# EAGLE design wifi-leds2 (EAGLE 9.5.0)

## Sheet 1 of 5
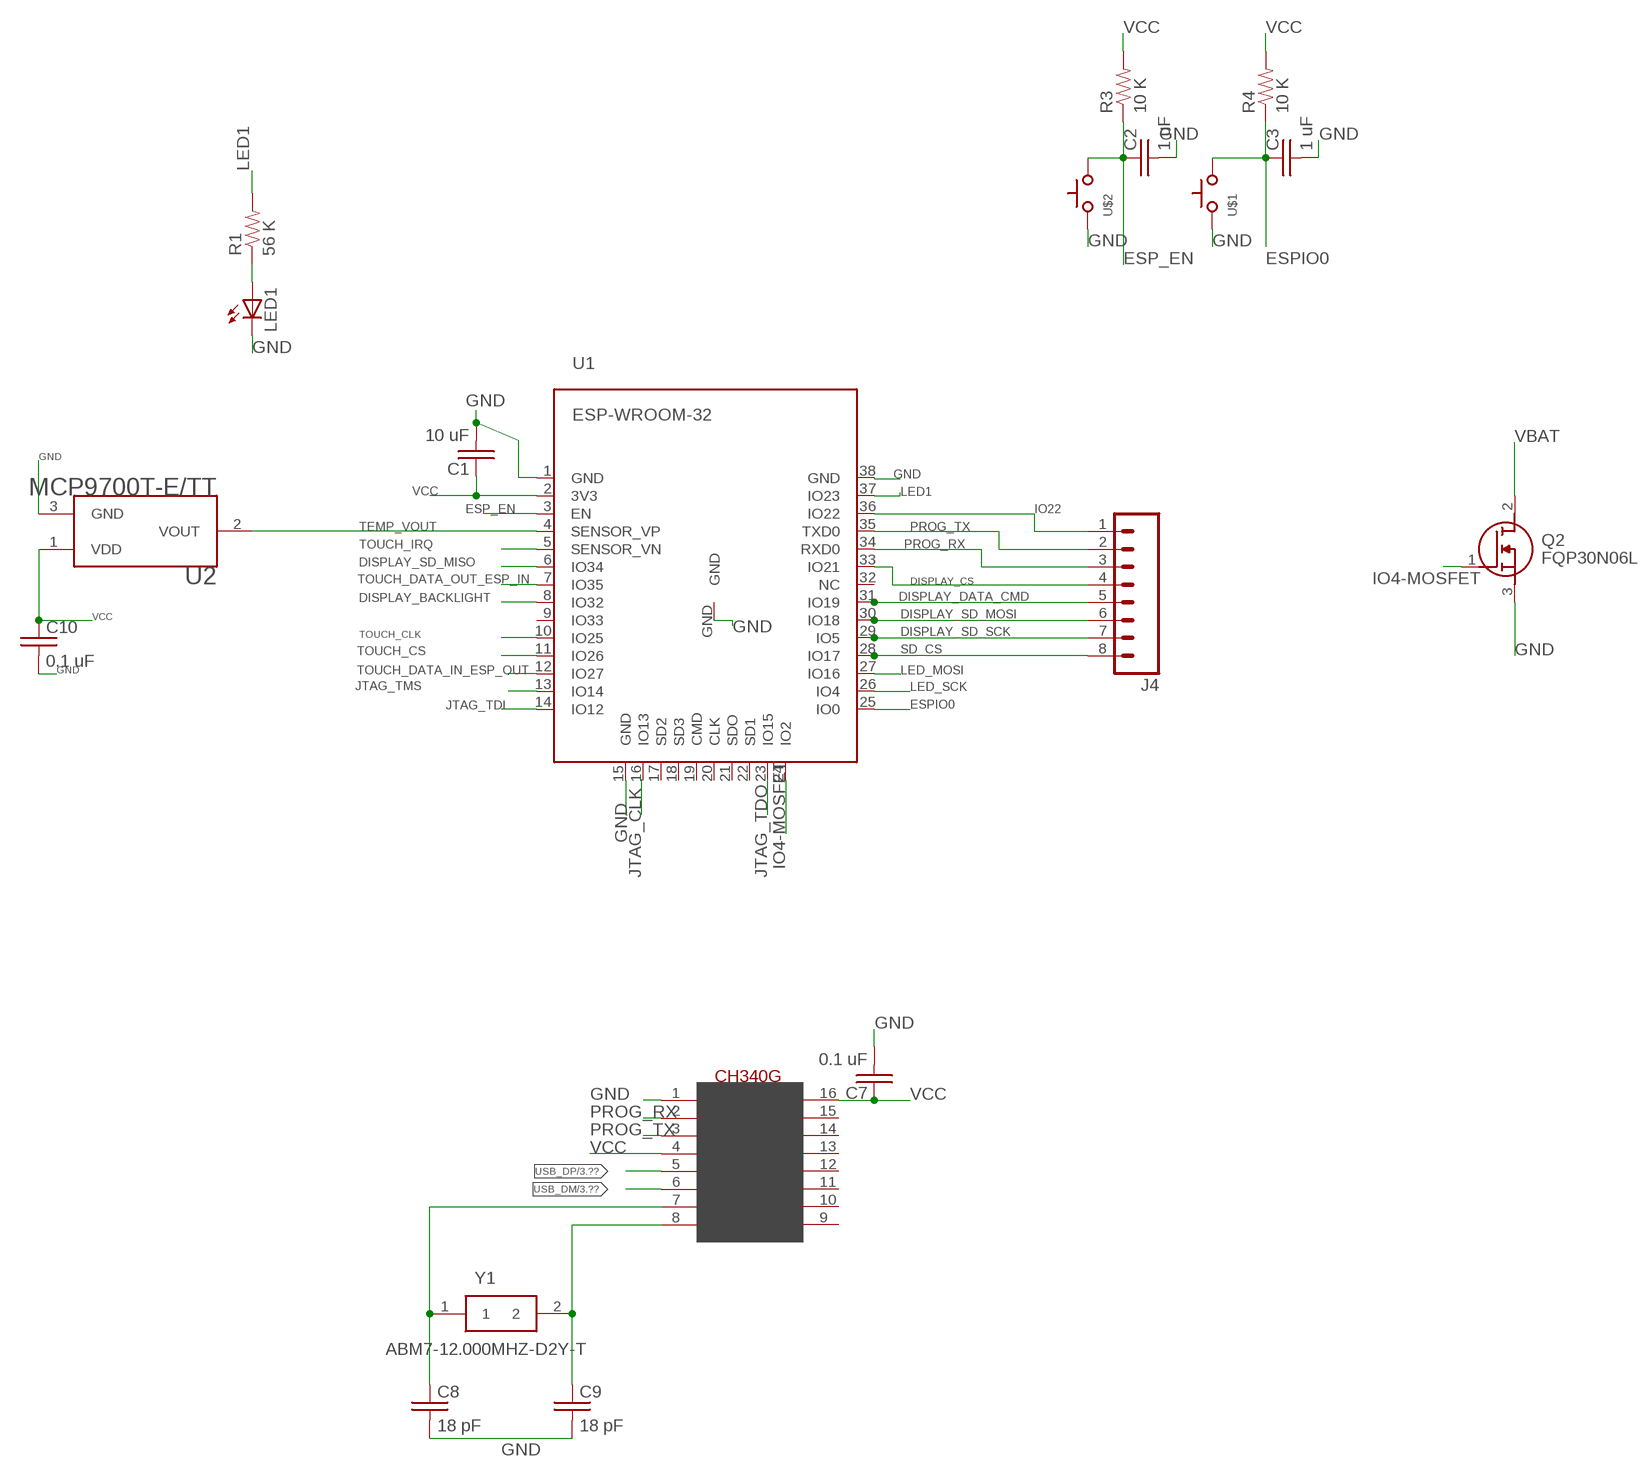
[diagram p0: schematic, sheet 1]

### Parts
C1  10 uF  C-USC0805  [C0805]
C2  1 uF  C-USC0805  [C0805]
C3  1 uF  C-USC0805  [C0805]
C7  0.1 uF  C-USC0805  [C0805]
C8  18 pF  C-USC0805  [C0805]
C9  18 pF  C-USC0805  [C0805]
C10  0.1 uF  C-USC0805  [C0805]
J4  M08  [1X08_ROUND]
LED1  LED3MM  [LED3MM]
Q2  FQP30N06L  [TO254P470X1016X2019-3P]
R1  56 K  RESISTOR0805-RES  [0805]
R3  10 K  RESISTOR0805-RES  [0805]
R4  10 K  RESISTOR0805-RES  [0805]
U1  ESP-WROOM-32  [ESP-WROOM-32]
U2  MCP9700T-E/TT  [SOT95P237X112-3N]
U$1  SWITCH_TACTILETACTILE-2PIN-NARROW  [TACTILE-2PIN-NARROW]
U$2  SWITCH_TACTILETACTILE-2PIN-NARROW  [TACTILE-2PIN-NARROW]
U$6  CH340G  [SOIC16]
Y1  ABM7-12.000MHZ-D2Y-T  [ABM7]

### Nets
DISPLAY_BACKLIGHT: U1.8(IO32) ; also sheet 4
DISPLAY_CS: J4.4 U1.33(IO21) ; also sheet 4
DISPLAY_DATA_CMD: J4.5 U1.31(IO19) ; also sheet 4
DISPLAY_SD_MISO: U1.6(IO34) ; also sheet 4
DISPLAY_SD_MOSI: J4.6 U1.30(IO18) ; also sheet 4
DISPLAY_SD_SCK: J4.7 U1.29(IO5) ; also sheet 4
ESP_EN: C2.1 R3.1 U1.3(EN) U$2.P$1(A)
ESPIO0: C3.1 R4.1 U1.25(IO0) U$1.P$1(A)
GND: C1.2 C2.2 C3.2 C7.2 C8.2 C9.2 C10.2 LED1.K(C) Q2.3(S) U1.1(GND) U1.15(GND) U1.38(GND) U1.GND U2.3(GND) U$1.P$2(C) U$2.P$2(C) U$6.1(GND) ; also sheet 2,3,4
IO4-MOSFET: Q2.1(G) U1.24(IO2)
IO22: J4.1 U1.36(IO22)
JTAG_CLK: U1.16(IO13) ; also sheet 2
JTAG_TDI: U1.14(IO12) ; also sheet 2
JTAG_TDO: U1.23(IO15) ; also sheet 2
JTAG_TMS: U1.13(IO14) ; also sheet 2
LED1: R1.2 U1.37(IO23)
LED_MOSI: U1.27(IO16) ; also sheet 2
LED_SCK: U1.26(IO4) ; also sheet 2
N$1: LED1.A R1.1
N$8: C8.1 U$6.7(XI) Y1.1
N$9: C9.1 U$6.8(XO) Y1.2
PROG_RX: J4.3 U1.34(RXD0) U$6.2(TX) ; also sheet 2
PROG_TX: J4.2 U1.35(TXD0) U$6.3(RX) ; also sheet 2
SD_CS: J4.8 U1.28(IO17) ; also sheet 4
TEMP_VOUT: U1.4(SENSOR_VP) U2.2(VOUT)
TOUCH_CLK: U1.10(IO25) ; also sheet 4
TOUCH_CS: U1.11(IO26) ; also sheet 4
TOUCH_DATA_IN_ESP_OUT: U1.12(IO27) ; also sheet 4
TOUCH_DATA_OUT_ESP_IN: U1.7(IO35) ; also sheet 4
TOUCH_IRQ: U1.5(SENSOR_VN) ; also sheet 4
USB_DM: U$6.6(D-) ; also sheet 3
USB_DP: U$6.5(D+) ; also sheet 3
VBAT [5v]: Q2.2(D) ; also sheet 2,3
VCC: C1.1 C7.1 C10.1 R3.2 R4.2 U1.2(3V3) U2.1(VDD) U$6.4(V3) U$6.16(VCC) ; also sheet 2,3,4
Unconnected: U1.9(IO33) U1.17(SD2) U1.18(SD3) U1.19(CMD) U1.20(CLK) U1.21(SDO) U1.22(SD1) U1.32(NC) U$6.9(CTS) U$6.10(DSR) U$6.11(RI) U$6.12(DCD) U$6.13(DTR) U$6.14(RTS) U$6.15(RS232)

## Sheet 2 of 5
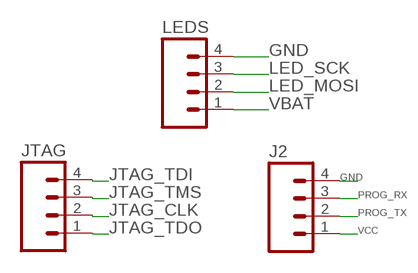
[diagram p1: schematic, sheet 2]

### Parts
J2  M04PTH  [1X04]
JTAG  M04PTH  [1X04]
LEDS  M04POLAR  [MOLEX-1X4]

### Nets
GND: J2.4 LEDS.4 ; also sheet 1,3,4
JTAG_CLK: JTAG.2 ; also sheet 1
JTAG_TDI: JTAG.4 ; also sheet 1
JTAG_TDO: JTAG.1 ; also sheet 1
JTAG_TMS: JTAG.3 ; also sheet 1
LED_MOSI: LEDS.2 ; also sheet 1
LED_SCK: LEDS.3 ; also sheet 1
PROG_RX: J2.3 ; also sheet 1
PROG_TX: J2.2 ; also sheet 1
VBAT [5v]: LEDS.1 ; also sheet 1,3
VCC: J2.1 ; also sheet 1,3,4

## Sheet 3 of 5
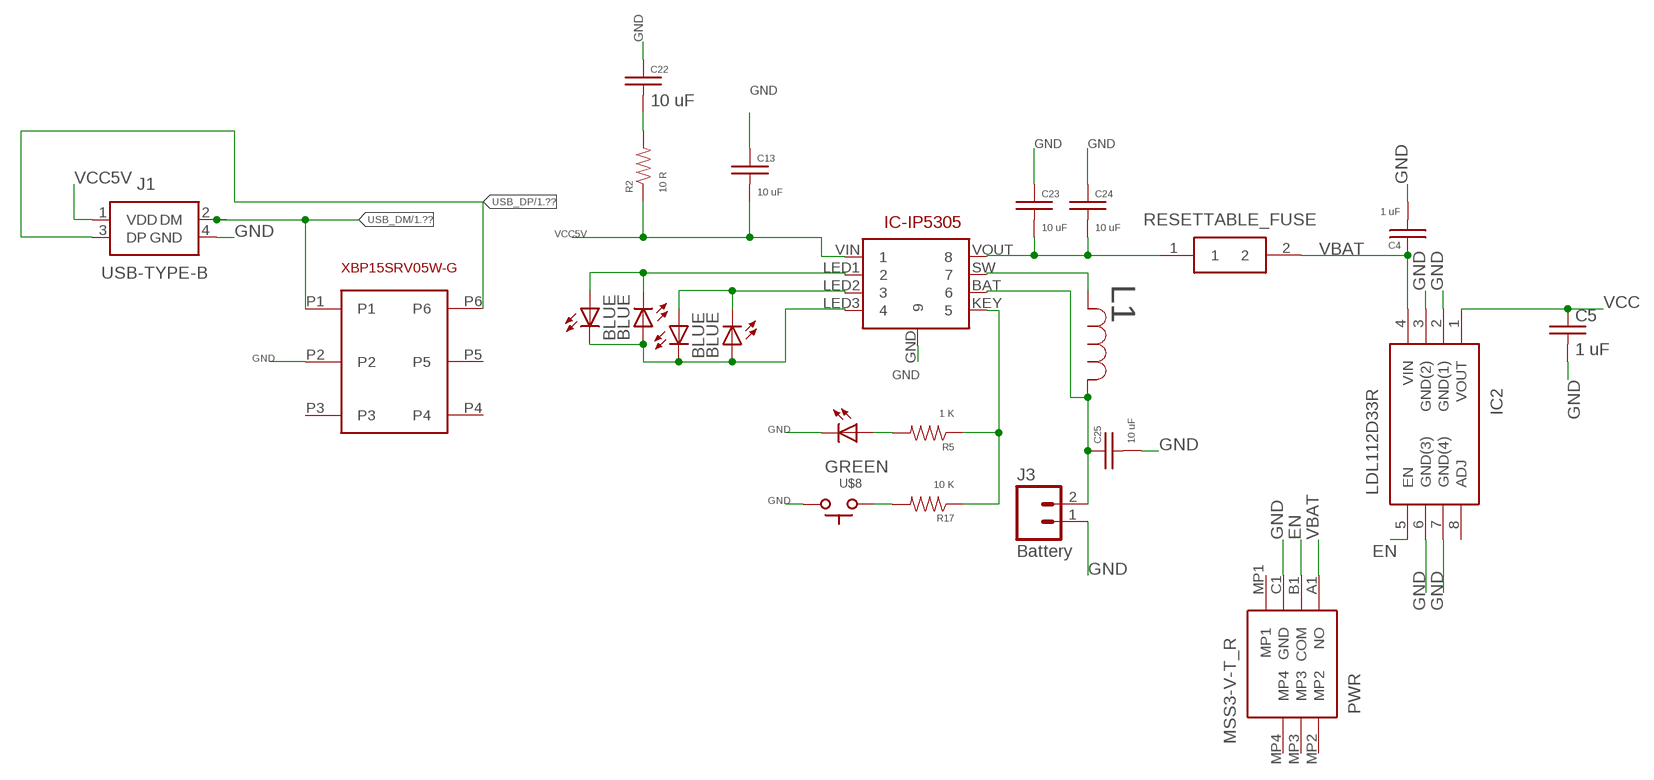
[diagram p2: schematic, sheet 3]

### Parts
C4  1 uF  C-USC0805  [C0805]
C5  1 uF  C-USC0805  [C0805]
C13  10 uF  C-USC0805  [C0805]
C22  10 uF  C-USC0805  [C0805]
C23  10 uF  C-USC0805  [C0805]
C24  10 uF  C-USC0805  [C0805]
C25  10 uF  C-USC0805  [C0805]
CL1  BLUE  LED1206  [LED-1206]
CL2  BLUE  LED1206  [LED-1206]
CL3  BLUE  LED1206  [LED-1206]
CL4  BLUE  LED1206  [LED-1206]
IC2  LDL112D33R  [SOIC127P600X175-8N]
IC-IP5305  IP5305ESOP8  [SOIC127P600X165-8]
J1  USB-TYPE-B  [61400413321]
J3  Battery  M02JST-PTH-2  [JST-2-PTH]
KEYLED  GREEN  LED1206  [LED-1206]
L1  2.2uH  NRS4018T2R2MDGJ  [IND_TAIYO_NRS4018]
PWR  MSS3-V-T_R  [MSS3VTR]
R2  10 R  RESISTOR0805-RES  [0805]
R5  1 K  RESISTOR0805-RES  [0805]
R17  10 K  RESISTOR0805-RES  [0805]
RESETTABLE_FUSE  0ZCJ0050FF2G  [FUSC3216X55N]
U$8  SWITCH_TACTILETACTILE-2PIN-NARROW  [TACTILE-2PIN-NARROW]
U$9  XBP15SRV05W-G  [SOT-26P-XBP15SRV05W-G]

### Nets
EN: IC2.5(EN) PWR.B1(COM)
GND: C4.2 C5.2 C13.1 C22.1 C23.1 C24.1 C25.2 IC2.2(GND(1)) IC2.3(GND(2)) IC2.6(GND(3)) IC2.7(GND(4)) IC-IP5305.GND J1.4(GND) J3.1 KEYLED.C PWR.C1(GND) U$8.P$1(A) U$9.P2 ; also sheet 1,2,4
N$5: CL1.A CL2.C IC-IP5305.LED1
N$14: CL3.A CL4.C IC-IP5305.LED2
N$15: CL1.C CL2.A CL3.C CL4.A IC-IP5305.LED3
N$16: C22.2 R2.2
N$17: IC-IP5305.SW L1.2
N$20: C25.1 IC-IP5305.BAT J3.2 L1.1
N$21: IC-IP5305.KEY R5.1 R17.1
N$24: KEYLED.A R5.2
N$25: R17.2 U$8.P$2(C)
N$27: C23.2 C24.2 IC-IP5305.VOUT RESETTABLE_FUSE.1
USB_DM: J1.2(DM) U$9.P1 ; also sheet 1
USB_DP: J1.3(DP) U$9.P6 ; also sheet 1
VBAT [5v]: C4.1 IC2.4(VIN) PWR.A1(NO) RESETTABLE_FUSE.2 ; also sheet 1,2
VCC: C5.1 IC2.1(VOUT) ; also sheet 1,2,4
VCC5V [5v]: C13.2 IC-IP5305.VIN J1.1(VDD) R2.1
Unconnected: IC2.8(ADJ) PWR.MP1 PWR.MP2 PWR.MP3 PWR.MP4 U$9.P3 U$9.P4 U$9.P5

## Sheet 4 of 5
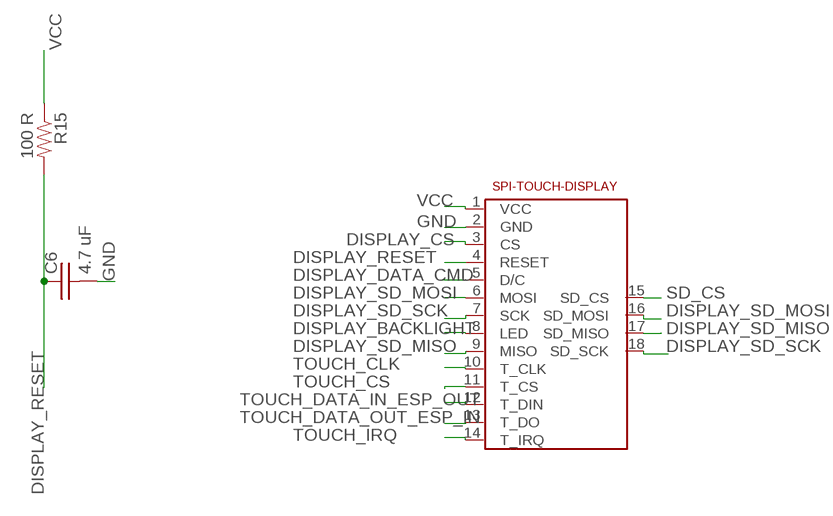
[diagram p3: schematic, sheet 4]

### Parts
C6  4.7 uF  C-USC0805  [C0805]
R15  100 R  RESISTOR0805-RES  [0805]
U$3  2.4-SPI-TFT-TOUCH-SSD-MODULE  [2.4-SPI-TFT-TOUCH-SSD-MODULE]

### Nets
DISPLAY_BACKLIGHT: U$3.8(LED) ; also sheet 1
DISPLAY_CS: U$3.3(CS) ; also sheet 1
DISPLAY_DATA_CMD: U$3.5(D/C) ; also sheet 1
DISPLAY_RESET: C6.1 R15.2 U$3.4(RESET)
DISPLAY_SD_MISO: U$3.9(MISO) U$3.17(SD_MISO) ; also sheet 1
DISPLAY_SD_MOSI: U$3.6(MOSI) U$3.16(SD_MOSI) ; also sheet 1
DISPLAY_SD_SCK: U$3.7(SCK) U$3.18(SD_SCK) ; also sheet 1
GND: C6.2 U$3.2(GND) ; also sheet 1,2,3
SD_CS: U$3.15(SD_CS) ; also sheet 1
TOUCH_CLK: U$3.10(T_CLK) ; also sheet 1
TOUCH_CS: U$3.11(T_CS) ; also sheet 1
TOUCH_DATA_IN_ESP_OUT: U$3.12(T_DIN) ; also sheet 1
TOUCH_DATA_OUT_ESP_IN: U$3.13(T_DO) ; also sheet 1
TOUCH_IRQ: U$3.14(T_IRQ) ; also sheet 1
VCC: R15.1 U$3.1(VCC) ; also sheet 1,2,3

## Sheet 5 of 5
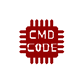
[diagram p4: schematic, sheet 5]

### Parts
U$5  CMD_C0DE_LOGOCMD_CODE_LOGO_TOP_COPPER  [CMD_C0DE_LOGO_TOP_COPPER]

## Library data of the parts
C1-C10 C13 C22-C25 = passives:C-US: CAPACITOR, American symbol
CL1-CL4 KEYLED LED1 = leds:LED: LEDs Standard schematic elements and footprints for 5mm, 3mm, 1206, and 0603 sized LEDs. 5mm - Spark Fun Electronics SKU : COM-00529 (and others)
IC2 = voltage-regulator:LDL112D33R: LDO Voltage Regulators 1.2 A low quiescent current LDO with reverse current protection Source: Datasheet <https://www.arrow.com/en/products/ldl112d33r/stmicroelectronics>; ARROW_PART_NUMBER: LDL112D33R; ARROW_PRICE/STOCK: https://www.arrow.com/en/products/ldl112d33r/stmicroelectronics; DESCRIPTION: LDO Voltage Regulators 1.2 A low quiescent current LDO with reverse current protection; HEIGHT: 1.75mm; MANUFACTURER_NAME: STMicroelectronics; MANUFACTURER_PART_NUMBER: LDL112D33R
IC-IP5305 = charging-ic:IP5305: IP5305
J1 = connector:USB-TYPE-B: WR-COM USB Connector B vertical Wurth Elektronik Straight PCB Mount Mount Female Type B USB Connector, 30 V ac, 1.5A Source: Datasheet <https://componentsearchengine.com/Datasheets/1/61400413321.pdf>; DESCRIPTION: WR-COM USB Connector B vertical Wurth Elektronik Straight PCB Mount Mount Female Type B USB Connector, 30 V ac, 1.5A; HEIGHT: mm; MANUFACTURER_NAME: Wurth Elektronik; MANUFACTURER_PART_NUMBER: 61400413321; MOUSER_PART_NUMBER: 710-61400413321; MOUSER_PRICE-STOCK: https://www.mouser.com/Search/Refine.aspx?Keyword=710-61400413321
J2 JTAG = connector:M04: Header 4 Standard 4-pin 0.1" header. Use with straight break away headers (SKU : PRT-00116), right angle break away headers (PRT-00553), swiss pins (PRT-00743), machine pins (PRT-00117), and female headers (PRT-00115). Molex polarized connector foot print use with SKU : PRT-08231 with associated crimp pins and housings. 1MM SMD Version SKU: PRT-10208; PROD_ID: CONN-09696
J3 = connector:M02: Standard 2-pin 0.1" header. Use with - straight break away headers ( PRT-00116) - right angle break away headers (PRT-00553) - swiss pins (PRT-00743) - machine pins (PRT-00117) - female headers (PRT-00115) Molex polarized connector foot print use with: PRT-08233 with associated crimp pins and housings. 2.54_SCREWTERM for use with PRT-10571. 3.5mm Screw Terminal footprints for PRT-08084 5mm Screw Terminal footprints for use with PRT-08432; PROD_ID: CONN-09863; SKU: PRT-09914
J4 = connector:M08: Header 8 Standard 8-pin 0.1" header. Use with straight break away headers (SKU : PRT-00116), right angle break away headers (PRT-00553), swiss pins (PRT-00743), machine pins (PRT-00117), and female headers (PRT-00115).; PROD_ID: CONN-08437
L1 = passives:NRS4018T2R2MDGJ: Inductor: CD43; MANUFACTURER_PART_NUMBER: NRS4018T2R2MDGJ; VENDOR: TAIYO YUDEN
LEDS = connector:M04: Header 4 Standard 4-pin 0.1" header. Use with straight break away headers (SKU : PRT-00116), right angle break away headers (PRT-00553), swiss pins (PRT-00743), machine pins (PRT-00117), and female headers (PRT-00115). Molex polarized connector foot print use with SKU : PRT-08231 with associated crimp pins and housings. 1MM SMD Version SKU: PRT-10208
PWR = switches:MSS3-V-T_R: Slide Switches Slide Type 1P2T (1.4mm height) Source: Datasheet <http://www.dip.com.tw/en/en-product-information/en-switch005/item/download/2643_3624e6da26abd0f9c3465d69564276ea>; DESCRIPTION: Slide Switches Slide Type 1P2T (1.4mm height); HEIGHT: 1.4mm; MANUFACTURER_NAME: Diptronics; MANUFACTURER_PART_NUMBER: MSS3-V-T/R; MOUSER_PART_NUMBER: 113-MSS3-V-T/R; MOUSER_PRICE-STOCK: https://www.mouser.com/Search/Refine.aspx?Keyword=113-MSS3-V-T%2FR
Q2 = transitors:FQP30N06L: FQP30N06L N-Channel MOSFET, 32 A, 60 V QFET, 3-Pin TO-220 ON Semiconductor Source: Datasheet <https://www.mouser.com/datasheet/2/308/FQP30N06L-1306227.pdf>; DESCRIPTION: FQP30N06L N-Channel MOSFET, 32 A, 60 V QFET, 3-Pin TO-220 ON Semiconductor; HEIGHT: 4.7mm; MANUFACTURER_NAME: ON Semiconductor; MANUFACTURER_PART_NUMBER: FQP30N06L; MOUSER_PART_NUMBER: 512-FQP30N06L; RS_PART_NUMBER: 8075863P; RS_PRICE-STOCK: http://uk.rs-online.com/web/p/products/8075863P
R1-R5 R17 = passives:RESISTOR: Resistor Basic schematic elements and footprints for 0603, 1206, and PTH resistors.
R15 = dc-26:RESISTOR: Resistor Basic schematic elements and footprints for 0603, 1206, and PTH resistors.
RESETTABLE_FUSE = passives:0ZCJ0050FF2G: Resettable Fuses - PPTC <https://componentsearchengine.com/Images/9/0ZCJ0050FF2G.jpg> Source: Datasheet <https://www.belfuse.com/resources/CircuitProtection/datasheets/0ZCJ Nov2016.pdf>; DESCRIPTION: Resettable Fuses - PPTC; HEIGHT: 0.55mm; MANUFACTURER_NAME: Bel-Stewart; MANUFACTURER_PART_NUMBER: 0ZCJ0050FF2G; SUPPLIER_NAME: RS
U1 = ICs:ESP-WROOM-32
U2 = sensors:MCP9700T-E/TT: Low-Power Linear Active Thermistor™ IC; AVAILABILITY: Unavailable; DESCRIPTION: MCP9700 Series 5 V -40 to +125°C Low-Power Linear Active Thermistor; MF: Microchip; MP: MCP9700T-E/TT; PACKAGE: SOT-23-3 Microchip; PRICE: None
U$1 U$2 U$8 = switches:SWITCH_TACTILE
U$3 = displays:2.4-SPI-TFT-TOUCH-SSD-MODULE: 2.4" SPI TFT Module Driver: ILI9341 DOTS: 240x320 Touch: YES
U$5 = logos:CMD_C0DE_LOGO
U$6 = protocol-converters:CH340G
U$9 = passives:XBP15SRV05W-G: Low Capacitance TVS Diode Array (used for USB) P1->D- (usb1) P2->GND P3->D- (usb2) P4->D+ (usb2) P5->NC P6->D+(usb1) Datasheet <https://www.torexsemi.com/file/xbp15srv05w/XBP15SRV05W.pdf>; DIGI_KEY_PART_NUMBER: 893-1422-1-ND; MANUFACTURER_PART_NUMBER: XBP15SRV05W-G
Y1 = crystals-timing:ABM7-12.000MHZ-D2Y-T: ABRACON - ABM7-12.000MHZ-D2Y-T - CRYSTAL, 12MHZ, 18PF, SMD Source: Datasheet <http://www.abracon.com/Resonators/abm7.pdf>; DESCRIPTION: ABRACON - ABM7-12.000MHZ-D2Y-T - CRYSTAL, 12MHZ, 18PF, SMD; HEIGHT: mm; MANUFACTURER_NAME: ABRACON; MANUFACTURER_PART_NUMBER: ABM7-12.000MHZ-D2Y-T; MOUSER_PART_NUMBER: 815-ABM7-12-D2Y-T; MOUSER_PRICE-STOCK: https://www.mouser.com/Search/Refine.aspx?Keyword=815-ABM7-12-D2Y-T; RS_PART_NUMBER: 1710625P; RS_PRICE-STOCK: http://uk.rs-online.com/web/p/products/1710625P

## Net classes
2 5v: width 0.254 mm, drill 0.8 mm, clearance 0.178 mm

## Board
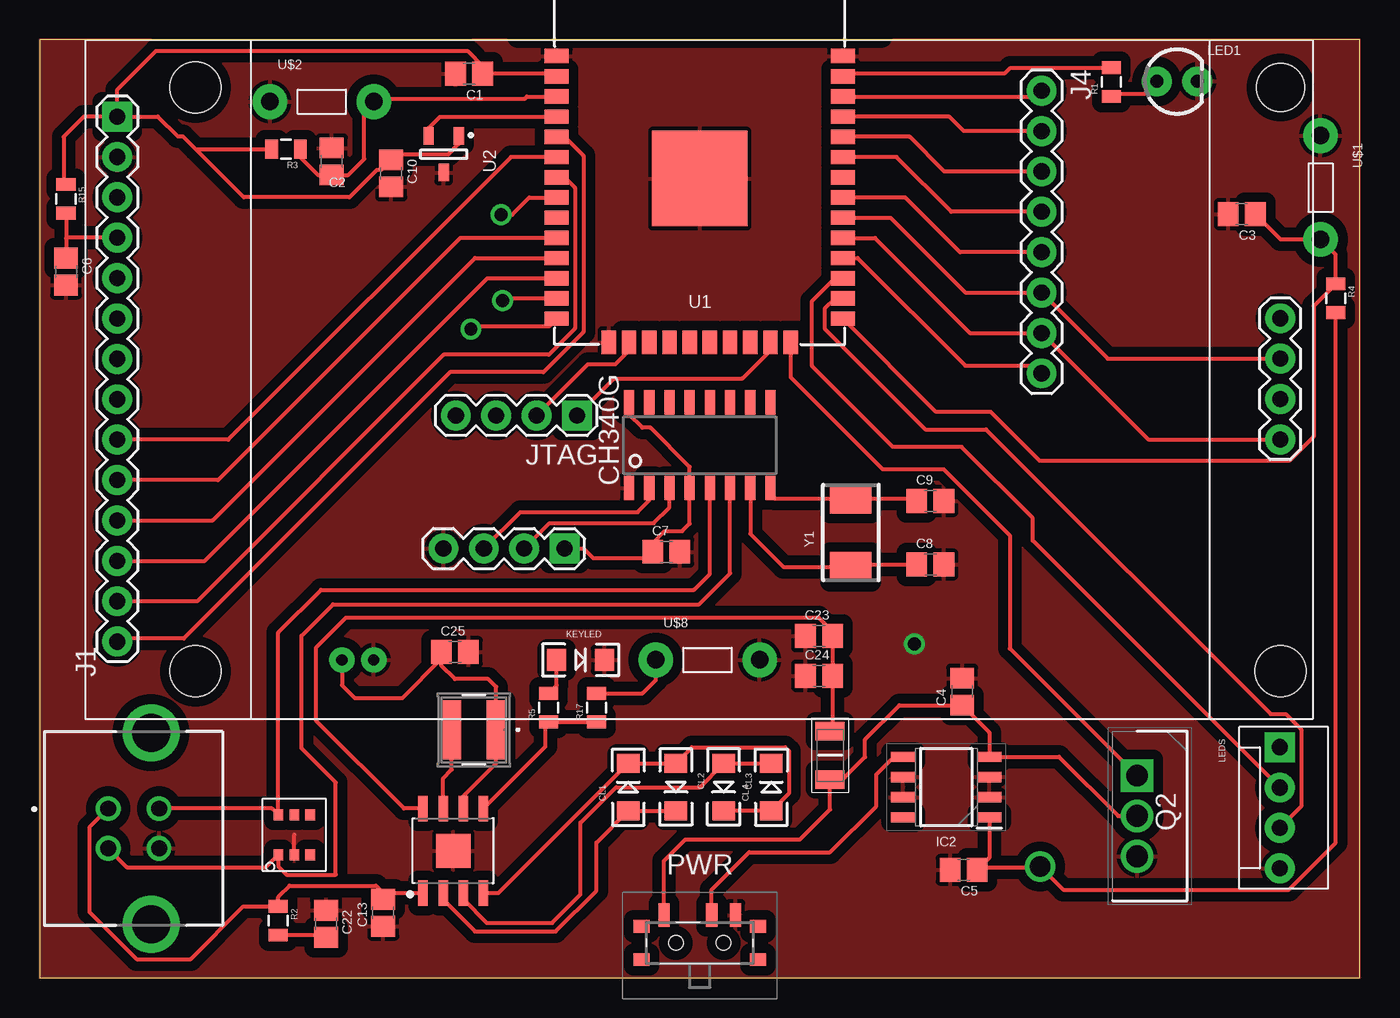
[diagram p5: board, top side]
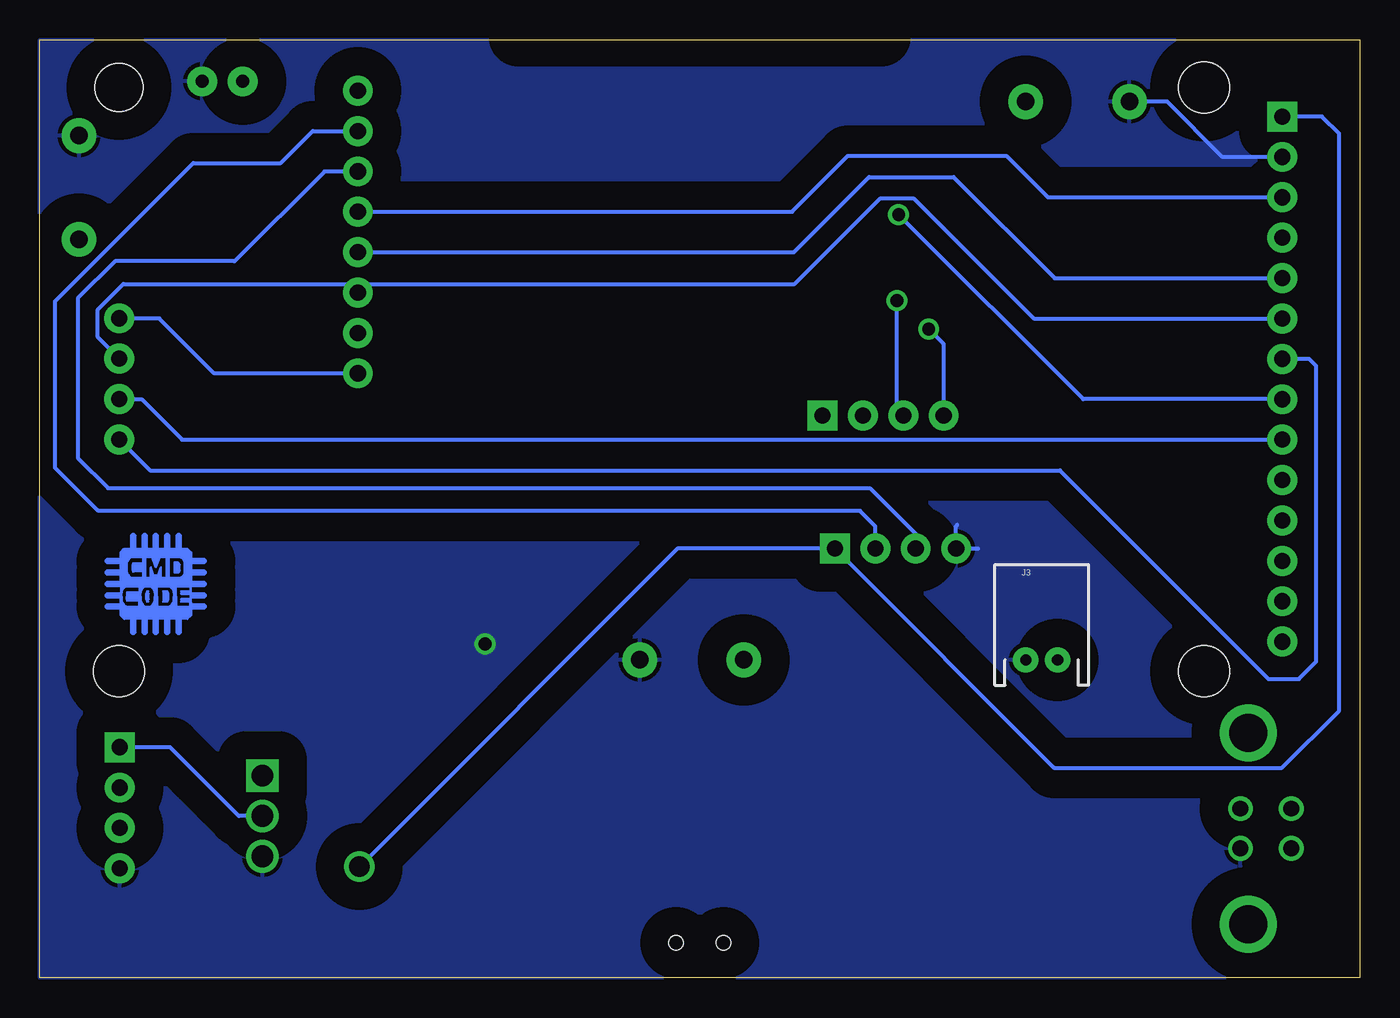
[diagram p6: board, bottom side, seen from below]

Size 83 x 59 mm. Coordinates in mm from the lower left corner, seen from the top.
Outline: 0,0 83,0 83,59 0,59 0,0
Copper layers (1*16): Top 0.035mm / dielectric 1.5mm / Bottom 0.035mm
Design rules "OthermillDRC_1_100_v2-cmd0de *": minimum track width 10mil, minimum drill 0.7mm, track to track 0.2797mm, track to pad 0.2797mm, pad to pad 0.256540625mm, via to via 0.256540625mm, smd to smd 0mil, copper to edge 0mil, drill to drill 1mil, minimum pad ring 10mil, minimum via ring 10mil, stop-mask expansion 1mil, vias tented up to drill 30mil, thermal gap 10mil

### Footprints (pad centres in the part's own frame; a part is rotated, then mirrored left to right if it is on the bottom)
C0805 = smd 1.3 x 1.5: 1 -0.85,0; 2 0.85,0
LED-1206 = smd 1.2 x 1.4: A -1.5,0; C 1.5,0
SOIC127P600X175-8N = smd 1.525 x 0.65: 1 -2.712,1.905; 2 -2.712,0.635; 3 -2.712,-0.635; 4 -2.712,-1.905; 5 2.712,-1.905; 6 2.712,-0.635; 7 2.712,0.635; 8 2.712,1.905
SOIC127P600X165-8 = smd 1.609 x 0.594: BAT 2.653,-0.635; KEY 2.653,-1.905; LED1 -2.653,0.635; LED2 -2.653,-0.635; LED3 -2.653,-1.905; SW 2.653,0.635; VIN -2.653,1.905; VOUT 2.653,1.905 | smd 2.15 x 2.15: GND 0,0
61400413321 = drill 1 pad 1.55: 1 1.25,2.7; 2 -1.25,2.7; 3 1.25,-0.5; 4 -1.25,-0.5 | drill 2.38 pad 3.59: 5 -6.02,0; 6 6.02,0
1X04 = drill 1.016 pad 1.88 square: 1 0,0 | drill 1.016 pad 1.88: 2 2.54,0; 3 5.08,0; 4 7.62,0
JST-2-PTH = drill 0.7 pad 1.6: 1 -1,0; 2 1,0
1X08_ROUND = drill 1.016 pad 1.88: 1 0,0; 2 2.54,0; 3 5.08,0; 4 7.62,0; 5 10.16,0; 6 12.7,0; 7 15.24,0; 8 17.78,0
IND_TAIYO_NRS4018 = smd 1.194 x 3.708: 1 -1.397,0; 2 1.397,0
LED3MM = drill 0.813 pad 1.88: A -1.27,0; K 1.27,0
MOLEX-1X4 = drill 1.016 pad 1.88 square: 1 0,0 | drill 1.016 pad 1.88: 2 2.54,0; 3 5.08,0; 4 7.62,0
MSS3VTR = smd 0.7 x 1.5: A1 -2.25,3.05; B1 0.75,3.05; C1 2.25,3.05 | smd 1 x 0.8: MP1 -3.65,2.35; MP2 -3.65,0.25; MP3 3.65,0.25; MP4 3.65,2.35 | hole 0.9: -1.5,1.3; 1.5,1.3
TO254P470X1016X2019-3P = drill 1.37 pad 2.055 square: 1 0,0 | drill 1.37 pad 2.055: 2 2.535,0; 3 5.07,0
0805 = smd 0.8 x 1.2: 1 -0.9,0; 2 0.9,0
FUSC3216X55N = smd 1.17 x 1.82: 1 -1.52,0; 2 1.52,0
ESP-WROOM-32 = smd 0.9 x 1.5: 1 7.7,9; 2 6.43,9; 3 5.16,9; 4 3.89,9; 5 2.62,9; 6 1.35,9; 7 0.08,9; 8 -1.19,9; 9 -2.46,9; 10 -3.73,9; 11 -5,9; 12 -6.27,9; 13 -7.54,9; 14 -8.81,9; 25 -8.81,-9; 26 -7.54,-9; 27 -6.27,-9; 28 -5,-9; 29 -3.73,-9; 30 -2.46,-9; 31 -1.19,-9; 32 0.08,-9; 33 1.35,-9; 34 2.62,-9; 35 3.89,-9; 36 5.16,-9; 37 6.43,-9; 38 7.7,-9 | smd 1.5 x 0.9: 15 -10.3,5.715; 16 -10.3,4.445; 17 -10.3,3.175; 18 -10.3,1.905; 19 -10.3,0.635; 20 -10.3,-0.635; 21 -10.3,-1.905; 22 -10.3,-3.175; 23 -10.3,-4.445; 24 -10.3,-5.715 | smd 6 x 6: GND 0,0
SOT95P237X112-3N = smd 1.1 x 0.65: 1 -1.15,0.95; 2 -1.15,-0.95; 3 1.15,0
TACTILE-2PIN-NARROW = drill 1.1 pad 2.184: P$1 3.264,0; P$2 -3.264,0
2.4-SPI-TFT-TOUCH-SSD-MODULE = drill 1.016 pad 1.88 square: 1 4.83,2.02 | drill 1.016 pad 1.88: 2 7.37,2.02; 3 9.91,2.02; 4 12.45,2.02; 5 14.99,2.02; 6 17.53,2.02; 7 20.07,2.02; 8 22.61,2.02; 9 25.15,2.02; 10 27.69,2.02; 11 30.23,2.02; 12 32.77,2.02; 13 35.31,2.02; 14 37.85,2.02; 15 17.52,75.14; 16 20.06,75.14; 17 22.6,75.14; 18 25.14,75.14 | hole 3: 3,75.16 | hole 3.2: 39.72,75.16; 39.72,6.92; 3,6.92
SOIC16 = smd 0.635 x 1.524: 1 -4.445,-2.695; 2 -3.175,-2.695; 3 -1.905,-2.695; 4 -0.635,-2.695; 5 0.635,-2.695; 6 1.905,-2.695; 7 3.175,-2.695; 8 4.445,-2.695; 9 4.445,2.695; 10 3.175,2.695; 11 1.905,2.695; 12 0.635,2.695; 13 -0.635,2.695; 14 -1.905,2.695; 15 -3.175,2.695; 16 -4.445,2.695
SOT-26P-XBP15SRV05W-G = smd 0.6 x 0.7: P1 -1,-1.25; P2 0,-1.25; P3 1,-1.25; P4 1,1.25; P5 0,1.25; P6 -1,1.25
ABM7 = smd 1.9 x 2.6: 1 -2.15,0; 2 2.15,0

### Placement (x,y rotation side)
C1  27,56.86 180 top
C2  18.36,51.35 90 top
C3  75.58,48.03 180 top
C4  58,18 90 top
C5  58.1,6.8 180 top
C6  1.65,44.42 270 top
C7  39.4,26.8 0 top
C8  56,26 0 top
C9  56,30 0 top
C10  22.1,50.6 270 top
C13  21.6,4.1 90 top
C22  18,3.4 270 top
C23  49,21.5 0 top
C24  49,19 0 top
C25  26.1,20.5 0 top
CL1  37,12 90 top
CL2  40,12 270 top
CL3  43,12 270 top
CL4  46,12 90 top
IC2  57,12 180 top
IC-IP5305  26,8 90 top
J1  7,9.4 90 top
J2  33,27 180 top
J3  20,20 0 bottom
J4  63,55.8 270 top
JTAG  33.78,35.37 180 top
KEYLED  34,20 0 top
L1  27.3,15.6 180 top
LED1  71.51,56.38 0 top
LEDS  77.97,14.51 270 top
PWR  41.5,0.9 0 top
Q2  69,12.72 270 top
R1  67.38,56.34 90 top
R2  15,3.6 270 top
R3  15.48,52.13 180 top
R4  81.48,42.74 270 top
R5  32,17 90 top
R15  1.65,49 270 top
R17  35,17 90 top
RESETTABLE_FUSE  49.7,14 270 top
U1  41.5,50.27 90 top
U2  25.4,51.8 270 top
U$1  80.53,49.71 270 top
U$2  17.74,55.11 0 top
U$3  2.86,59 270 top
U$5  75.7,25.1 0 bottom
U$6  41.5,33.5 0 top
U$8  42,20 0 top
U$9  16,9 0 top
Y1  51,28 90 top

### Tracks (layer width: path | path; a pad name or v marks a point on that pad's centre or on a via)
DISPLAY_BACKLIGHT  (via drill 0.8)
  Top 0.254: v29,48 29.7,48 30.78,49.08 U1.8
  Bottom 0.254: U$3.8 17.39,36.39 v29,48
DISPLAY_CS
  Top 0.254: J4.4 57.32,48.18 53.88,51.62 U1.33
  Bottom 0.254: J4.4 35.7,48.18 32.17,51.7 22.22,51.7 19.61,49.09 U$3.3
DISPLAY_DATA_CMD
  Top 0.254: U1.31 54.42,49.08 57.86,45.64 J4.5
  Bottom 0.254: J4.5 35.58,45.64 30.85,50.37 25.54,50.37 19.18,44.01 U$3.5
DISPLAY_RESET
  Top 0.254: R15.2 1.65,46.5 | 1.65,46.5 C6.1 | U$3.4 1.7,46.55 1.65,46.5
DISPLAY_SD_MISO
  Top 0.254: U1.6 29.62,51.62 11.85,33.85 U$3.9
  Bottom 0.254: U$3.17 76.6,36.4 74.05,33.85 U$3.9
DISPLAY_SD_MOSI
  Top 0.254: U1.30 53.49,47.81 58.2,43.1 J4.6 67.16,38.94 U$3.16
  Bottom 0.254: U$3.6 20.5,41.47 28.07,49.04 30.13,49.04 35.53,43.64 77.75,43.64 79.35,42.04 79.35,40.29 U$3.16
DISPLAY_SD_SCK
  Top 0.254: U1.29 52.52,46.54 58.5,40.56 J4.7 69.7,33.86 U$3.18
  Bottom 0.254: U$3.18 76.06,31.92 18.85,31.92 5.74,18.8 3.82,18.8 2.73,19.89 2.73,38.48 3.18,38.93 U$3.7
EN
  Top 0.254: PWR.B1 42.25,5.55 44.6,7.9 49.7,7.9 52.6,10.8 52.6,12.8 53.7,13.9 IC2.5
ESP_EN
  Top 0.254: U1.3 30.63,55.43 30.5,55.3 21.19,55.3 U$2.P$1 20.4,54.51 20.4,51.5 19.4,50.5 C2.1 17.5,50.5 16.38,51.62 R3.1
ESPIO0
  Top 0.254: U1.25 56.36,35.6 59.8,35.6 62.89,32.51 78.56,32.51 80.1,34.06 80.1,42.26 R4.1 81.48,45.5 U$1.P$1 78.01,46.45 C3.1
GND  (via drill 0.8)
  Top 0.254: U$9.P2 16,9
  Bottom 0.254: U$3.2 8.63,51.63 12.11,55.11 U$2.P$2 | 24,27 J2.4 25.38,28.42 25.3,28.5
  other vias: 55,21
  pour Bottom (isolate 1.778): 0,59 0,0 83,0 83,59
  pour Top (isolate 0.61): 0,59 0,0 83,0 83,59
IO4-MOSFET
  Top 0.254: U1.24 47.22,37.77 52.99,32 56.83,32 61,27.82 61,20.72 Q2.1
IO22
  Top 0.254: U1.36 62.63,55.43 J4.1
JTAG_CLK
  Top 0.254: U1.16 37.05,39.47 36.19,38.6 34.47,38.6 JTAG.2
JTAG_TDI  (via drill 0.8)
  Top 0.254: v27.1,40.8 27.3,41 32.04,41 U1.14
  Bottom 0.254: JTAG.4 26.16,39.86 v27.1,40.8
JTAG_TDO
  Top 0.254: JTAG.1 36.11,37.7 44.18,37.7 45.95,39.47 U1.23
JTAG_TMS  (via drill 0.8)
  Top 0.254: U1.13 29.23,42.73 v29.1,42.6
  Bottom 0.254: JTAG.3 29.1,35.77 v29.1,42.6
LED1
  Top 0.254: U1.37 50.7,56.9 60.7,56.9 61.04,57.24 R1.2
LED_MOSI
  Top 0.254: LEDS.2 62.43,27.51 62.43,28.92 57.95,33.4 53.65,33.4 48.57,38.48 48.57,42.57 49.99,44 U1.27
LED_SCK
  Top 0.254: U1.26 49.99,42.73 49.34,42.08 49.34,40.84 55.69,34.5 59.5,34.5 77.4,16.6 78.33,16.6 79.32,15.62 79.32,10.78 LEDS.3
N$1
  Top 0.254: R1.1 67.54,55.6 69.46,55.6 LED1.A
N$5
  Top 0.254: CL2.C CL1.A 35,8.5 35,5.49 32.44,2.93 27.37,2.93 25.36,4.94 IC-IP5305.LED1
N$8
  Top 0.254: U$6.7 44.67,27.93 46.75,25.85 Y1.1 51.15,26 C8.1
N$9
  Top 0.254: U$6.8 46.2,30.15 Y1.2 55,30.15 C9.1
N$14
  Top 0.254: CL4.C CL3.A 41.5,12 36.24,12 34,9.76 34,5.25 32.22,3.47 28.11,3.47 26.64,4.94 IC-IP5305.LED2
N$15
  Top 0.254: CL3.C CL4.A 47.11,11.61 47.11,14.27 46.87,14.51 41.01,14.51 CL2.A CL1.C 28.84,5.35 IC-IP5305.LED3
N$16
  Top 0.254: R2.2 17.85,2.7 C22.2
N$17
  Top 0.254: IC-IP5305.SW 25.36,12.56 25.9,13.1 L1.2
N$20
  Top 0.254: IC-IP5305.BAT 26.64,11.44 28.7,13.5 L1.1 28.7,18.3 28.2,18.8 26.1,18.8 25.25,19.65 C25.1 25.25,20.05 22.8,17.6 19.8,17.6 19,18.4 J3.2
N$21
  Top 0.254: R17.1 R5.1 31.8,15.9 31.8,14.55 IC-IP5305.KEY
N$24
  Top 0.254: R5.2 32.5,18.4 KEYLED.A
N$25
  Top 0.254: R17.2 37.9,17.9 38.74,18.74 U$8.P$2
N$27
  Top 0.254: RESETTABLE_FUSE.1 49.85,15.67 C24.2 C23.2 49.85,21.77 48.97,22.66 19.25,22.66 17.39,20.8 17.39,16.16 22.89,10.65 IC-IP5305.VOUT
PROG_RX
  Top 0.254: J2.3 30.22,29.3 37.6,29.3 38.33,30.02 U$6.2 | U1.34 54.71,52.89 56.88,50.72 J4.3
  Bottom 0.254: J4.3 65.1,50.72 70.75,45.07 78.27,45.07 80.6,42.74 80.6,32.7 78.7,30.8 30.8,30.8 27.92,27.92 J2.3
PROG_TX
  Top 0.254: J2.2 32.06,28.6 38.6,28.6 39.59,29.59 U$6.3 | U1.35 57.2,54.16 58.1,53.26 J4.2
  Bottom 0.254: J2.2 30.46,28.4 31.43,29.37 79.32,29.37 82.03,32.08 82.03,42.56 73.34,51.25 67.85,51.25 65.84,53.26 J4.2
SD_CS
  Top 0.254: U1.28 51.43,45.27 58.2,38.5 62.52,38.5 J4.8
  Bottom 0.254: J4.8 72.02,38.02 75.48,41.48 U$3.15
TEMP_VOUT
  Top 0.254: U2.2 24.45,53.45 25.16,54.16 U1.4
TOUCH_CLK
  Top 0.254: U1.10 26.44,46.54 11.21,31.31 U$3.10
TOUCH_CS
  Top 0.254: U1.11 27.37,45.27 10.87,28.77 U$3.11
TOUCH_DATA_IN_ESP_OUT
  Top 0.254: U$3.12 10.38,26.23 28.16,44 U1.12
TOUCH_DATA_OUT_ESP_IN
  Top 0.254: U1.7 33.01,50.35 33.66,49.7 33.66,40.84 32.02,39.2 25.4,39.2 9.89,23.69 U$3.13
TOUCH_IRQ
  Top 0.254: U$3.14 5.08,21.35 9.05,21.35 25.8,38.1 31.67,38.1 34.19,40.62 34.19,51.7 33.01,52.89 U1.5
USB_DM
  Top 0.254: U$6.6 43.41,25.45 41.45,23.5 18.44,23.5 16.46,21.52 16.46,14.44 18.61,12.29 18.61,6.49 15.53,6.49 15,7.03 U$9.P1 14.22,6.97 5.48,6.97 J1.2
USB_DP
  Top 0.254: J1.3 14.6,10.65 U$9.P6 15,21.72 17.68,24.4 41.12,24.4 42.13,25.41 U$6.5
VBAT
  Top 0.254: PWR.A1 39.25,7.35 40.6,8.7 47.8,8.7 49.7,10.6 RESETTABLE_FUSE.2 49.82,12.6 50.6,12.6 51.9,13.9 51.9,15 54.05,17.15 C4.1 59.71,15.44 IC2.4 64.09,13.9 67.81,10.19 Q2.2
  Bottom 0.254: Q2.2 70.48,10.19 74.81,14.51 LEDS.1
VCC  (via drill 1.27)
  Top 0.254: J2.1 34.2,27 34.8,26.4 38.15,26.4 C7.1 38.55,27.35 39.3,28.1 40.4,28.1 40.87,28.57 U$6.4 40.87,32.13 38.4,34.6 37.9,34.6 37.05,35.45 U$6.16 | U$3.1 7.43,54.17 8.67,52.93 9,52.93 9.8,52.13 | 9.8,52.13 R3.2 | U$3.1 4.88,55.87 7.31,58.3 26.9,58.3 27.85,57.35 C1.1 32.34,56.86 U1.2 | U$3.1 2.77,54.17 1.5,52.9 1.5,50.05 R15.1 | v62.9,7 62.95,6.95 | 62.95,6.95 64.36,5.54 78.53,5.54 81.48,8.5 R4.2 | 9.8,52.13 12.83,49.1 19.48,49.1 21.18,50.81 21.46,50.81 C10.1 22.45,51.8 25.7,51.8 26.35,52.45 U2.1 | IC2.1 59.71,7.56 C5.1 59.1,6.95 62.95,6.95
  Bottom 0.254: v62.9,7 42.9,27 J2.1 19.22,13.22 4.89,13.22 1.3,16.81 1.3,53.09 2.38,54.17 U$3.1
VCC5V
  Top 0.254: IC-IP5305.VIN 22,5.35 C13.2 21.6,5.35 21.15,5.8 15.7,5.8 15,5.1 R2.1 12.8,4.5 9.48,1.18 6.09,1.18 3.12,4.15 3.12,9.47 J1.1